# EAGLE design BalloonDogV3 (EAGLE 9.3.2)
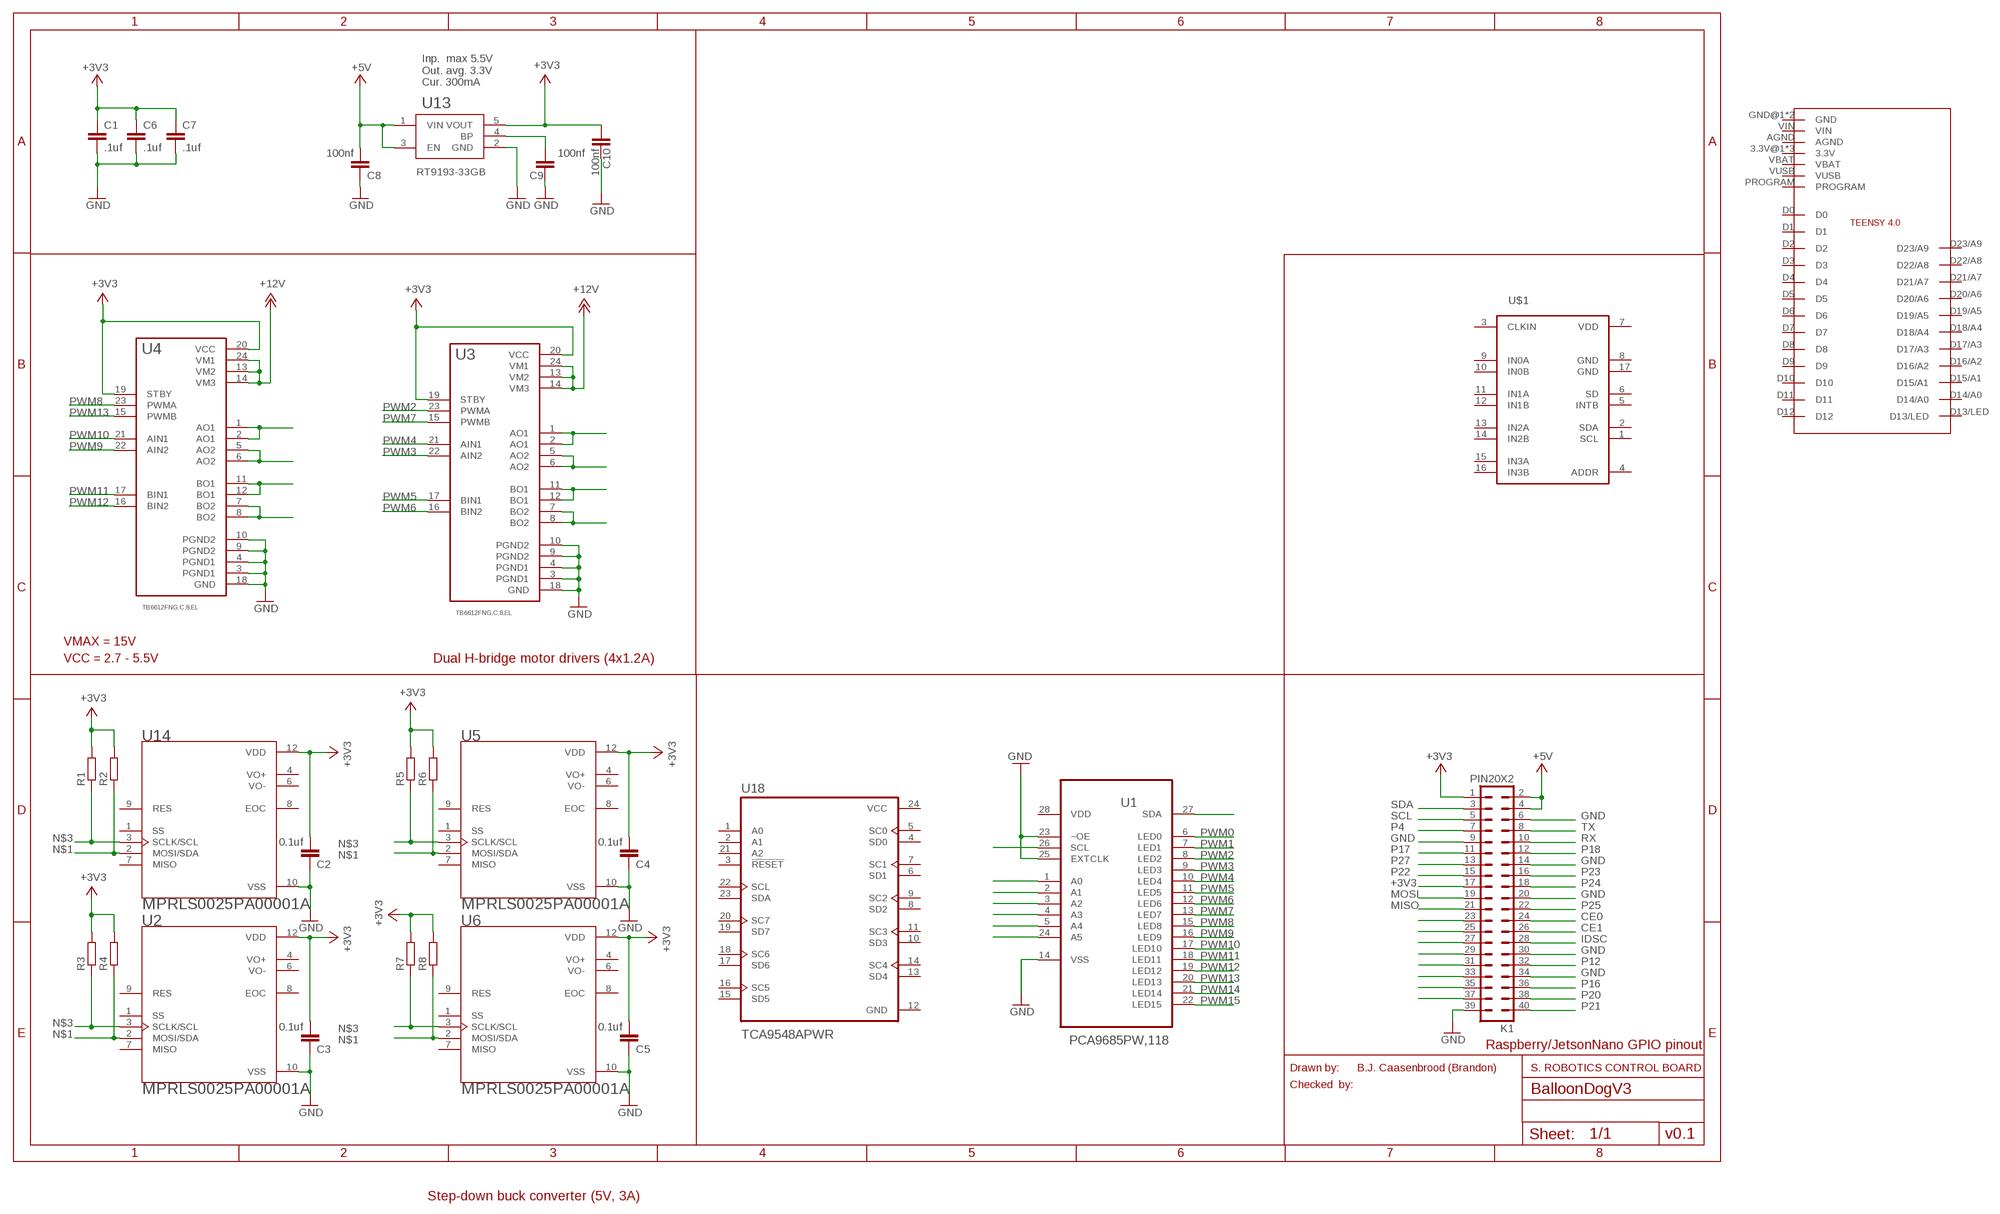
[diagram p0: schematic, sheet 1]

## Parts
C1  .1uf  C-EUC0805K  [C0805K]
C2  0.1uf  C-EUC0603  [C0603]
C3  0.1uf  C-EUC0603  [C0603]
C4  0.1uf  C-EUC0603  [C0603]
C5  0.1uf  C-EUC0603  [C0603]
C6  .1uf  C-EUC0805K  [C0805K]
C7  .1uf  C-EUC0805K  [C0805K]
C8  100nf  C-EUC0603  [C0603]
C9  100nf  C-EUC0603  [C0603]
C10  100nf  C-EUC0603  [C0603]
K1  PIN20X2  [PIN_20X2]
R1  R-EU_R0603  [R0603]
R2  R-EU_R0603  [R0603]
R3  R-EU_R0603  [R0603]
R4  R-EU_R0603  [R0603]
R5  R-EU_R0603  [R0603]
R6  R-EU_R0603  [R0603]
R7  R-EU_R0603  [R0603]
R8  R-EU_R0603  [R0603]
U1  PCA9685PW,118  [SOP65P640X110-28N]
U2  MPRLS0025PA00001A  [XDCR_MPRLS0025PA00001A]
U3  TB6612FNG,C,8,EL  [SOP65P760X160-24N]
U4  TB6612FNG,C,8,EL  [SOP65P760X160-24N]
U5  MPRLS0025PA00001A  [XDCR_MPRLS0025PA00001A]
U6  MPRLS0025PA00001A  [XDCR_MPRLS0025PA00001A]
U13  RT9193-33GB  [SOT94P279X129-5N]
U14  MPRLS0025PA00001A  [XDCR_MPRLS0025PA00001A]
U18  TCA9548APWR  [SOP65P640X120-24N]
U$1  LDC1614  [LDC1614]
U$2  TEENSY4.0  [TEENSY4.0]

## Nets
+3V3: C1.1 C2.2 C3.2 C4.2 C5.2 C6.1 C7.1 C10.2 K1.1 K1.17 R1.2 R2.2 R3.2 R4.2 R5.2 R6.2 R7.2 R8.2 U2.12(VDD) U3.19(STBY) U3.20(VCC) U4.19(STBY) U4.20(VCC) U5.12(VDD) U6.12(VDD) U13.5(VOUT) U14.12(VDD)
+5V: C8.2 K1.2 K1.4 U13.1(VIN) U13.3(EN)
+12V: U3.13(VM2) U3.14(VM3) U3.24(VM1) U4.13(VM2) U4.14(VM3) U4.24(VM1)
CE0: K1.24
CE1: K1.26
GND: C1.2 C2.1 C3.1 C4.1 C5.1 C6.2 C7.2 C8.1 C9.1 C10.1 K1.6 K1.9 K1.14 K1.20 K1.30 K1.34 K1.39 U1.14(VSS) U1.23(~OE) U1.25(EXTCLK) U2.10(VSS) U3.3(PGND1) U3.4(PGND1) U3.9(PGND2) U3.10(PGND2) U3.18(GND) U4.3(PGND1) U4.4(PGND1) U4.9(PGND2) U4.10(PGND2) U4.18(GND) U5.10(VSS) U6.10(VSS) U13.2(GND) U14.10(VSS)
IDSC: K1.28
MISO: K1.21
MOSI: K1.19
N$1: R2.1 R4.1 R6.1 R8.1 U2.2(MOSI/SDA) U5.2(MOSI/SDA) U6.2(MOSI/SDA) U14.2(MOSI/SDA)
N$2: K1.25
N$3: R1.1 R3.1 R5.1 R7.1 U2.3(SCLK/SCL) U5.3(SCLK/SCL) U6.3(SCLK/SCL) U14.3(SCLK/SCL)
N$9: K1.23
N$10: K1.27
N$11: K1.29
N$12: K1.31
N$13: K1.33
N$14: K1.35
N$15: K1.37
N$22: U3.1(AO1) U3.2(AO1)
N$23: U3.5(AO2) U3.6(AO2)
N$24: U3.11(BO1) U3.12(BO1)
N$25: U3.7(BO2) U3.8(BO2)
N$32: U4.1(AO1) U4.2(AO1)
N$33: U4.5(AO2) U4.6(AO2)
N$34: U4.11(BO1) U4.12(BO1)
N$35: U4.7(BO2) U4.8(BO2)
N$36: U1.27(SDA)
N$37: U1.26(SCL)
N$42: U1.1(A0)
N$43: U1.2(A1)
N$44: U1.3(A2)
N$45: U1.4(A3)
N$46: U1.5(A4)
N$47: U1.24(A5)
N$58: C9.2 U13.4(BP)
P4: K1.7
P12: K1.32
P16: K1.36
P17: K1.11
P18: K1.12
P20: K1.38
P21: K1.40
P22: K1.15
P23: K1.16
P24: K1.18
P25: K1.22
P27: K1.13
PWM0: U1.6(LED0)
PWM1: U1.7(LED1)
PWM2: U1.8(LED2) U3.23(PWMA)
PWM3: U1.9(LED3) U3.22(AIN2)
PWM4: U1.10(LED4) U3.21(AIN1)
PWM5: U1.11(LED5) U3.17(BIN1)
PWM6: U1.12(LED6) U3.16(BIN2)
PWM7: U1.13(LED7) U3.15(PWMB)
PWM8: U1.15(LED8) U4.23(PWMA)
PWM9: U1.16(LED9) U4.22(AIN2)
PWM10: U1.17(LED10) U4.21(AIN1)
PWM11: U1.18(LED11) U4.17(BIN1)
PWM12: U1.19(LED12) U4.16(BIN2)
PWM13: U1.20(LED13) U4.15(PWMB)
PWM14: U1.21(LED14)
PWM15: U1.22(LED15)
RX: K1.10
SCL: K1.5
SDA: K1.3
TX: K1.8
Unconnected: U2.1(SS) U2.4(VO+) U2.6(VO-) U2.7(MISO) U2.8(EOC) U2.9(RES) U5.1(SS) U5.4(VO+) U5.6(VO-) U5.7(MISO) U5.8(EOC) U5.9(RES) U6.1(SS) U6.4(VO+) U6.6(VO-) U6.7(MISO) U6.8(EOC) U6.9(RES) U14.1(SS) U14.4(VO+) U14.6(VO-) U14.7(MISO) U14.8(EOC) U14.9(RES) U18.1(A0) U18.2(A1) U18.3(!RESET) U18.4(SD0) U18.5(SC0) U18.6(SD1) U18.7(SC1) U18.8(SD2) U18.9(SC2) U18.10(SD3) U18.11(SC3) U18.13(SD4) U18.14(SC4) U18.15(SD5) U18.16(SC5) U18.17(SD6) U18.18(SC6) U18.19(SD7) U18.20(SC7) U18.21(A2) U18.22(SCL) U18.23(SDA) U$1.1(SCL) U$1.2(SDA) U$1.3(CLKIN) U$1.4(ADDR) U$1.5(INTB) U$1.6(SD) U$1.7(VDD) U$1.8(GND) U$1.9(IN0A) U$1.10(IN0B) U$1.11(IN1A) U$1.12(IN1B) U$1.13(IN2A) U$1.14(IN2B) U$1.15(IN3A) U$1.16(IN3B) U$1.17(GND) U$2.3.3V@1(3.3V) U$2.3.3V@2(3.3V) U$2.AGND U$2.D0 U$2.D1 U$2.D2 U$2.D3 U$2.D4 U$2.D5 U$2.D6 U$2.D7 U$2.D8 U$2.D9 U$2.D10 U$2.D11 U$2.D12 U$2.D13/LED U$2.D14/A0 U$2.D15/A1 U$2.D16/A2 U$2.D17/A3 U$2.D18/A4 U$2.D19/A5 U$2.D20/A6 U$2.D21/A7 U$2.D22/A8 U$2.D23/A9 U$2.GND@1(GND) U$2.GND@2(GND) U$2.ON/OFF(3.3V) U$2.PROGRAM U$2.VBAT U$2.VIN U$2.VUSB

## Notes on the sheet
- Inp.  max 5.5V
  Out. avg. 3.3V
  Cur. 300mA
- VMAX = 15V
- VCC = 2.7 - 5.5V | Dual H-bridge motor drivers (4x1.2A)
- Raspberry/JetsonNano GPIO pinout
- Drawn by: | B.J. Caasenbrood (Brandon) | S. ROBOTICS CONTROL BOARD
- Checked  by:
- v0.1
- Step-down buck converter (5V, 3A)

## Power pins joined to a net without a drawn wire
GND: U18.12(GND)
VCC: U18.24(VCC)
VDD: U1.28(VDD)

## Library data of the parts
C1 C6 C7 = resistor:C-EU: CAPACITOR, European symbol; DIELECTRIC: X7R
C2-C5 C8-C10 = rcl:C-EU: CAPACITOR, European symbol; SPICEPREFIX: C
K1 = FLYFISH:PIN20X2
R1-R8 = rcl:R-EU_: RESISTOR, European symbol; SPICEPREFIX: R
U1 = PCA9685PW_118:PCA9685PW,118: 16-channel, 12-bit PWM Fm+ I2C-bus LED controller; AVAILABILITY: Unavailable; DESCRIPTION: PCA9685 Series 5.5V 25 mA 1 MHz 12-bit PWM Fm+I2C-Bus LED Controller - TSSOP-28; MF: NXP USA; MP: PCA9685PW,118; PACKAGE: TSSOP-28 NXP Semiconductors; PRICE: None
U2 U5 U6 U14 = MPRLS0025PA00001A:MPRLS0025PA00001A: Pressure Sensor 0psi to 25psi Absolute 12-Pin T/R; AVAILABILITY: Unavailable; DESCRIPTION: Pressure Sensor 0psi to 25psi Absolute 12-Pin T/R; MF: Honeywell Sensing; MP: MPRLS0025PA00001A; PACKAGE: SMD-10 Honeywell; PRICE: None
U3 U4 = TB6612FNG_C_8_EL:TB6612FNG,C,8,EL: Stepping Motor Driver Ic Unipolor Copper Wire 8"; DESCRIPTION: Stepping Motor Driver Ic Unipolor Copper Wire 8; DIGI-KEY_PART_NUMBER: TB6612FNGC8ELCT-ND; DIGI-KEY_PURCHASE_URL: https://www.digikey.nl/product-detail/en/toshiba-semiconductor-and-storage/TB6612FNG,C,8,EL/TB6612FNGC8ELCT-ND/1730134?WT.z_cid=ref_snapeda&utm_source=snapeda&utm_medium=aggregator&utm_campaign=buynow; MF: Toshiba; MP: TB6612FNG,C,8,EL; PACKAGE: SSOP-24 Toshiba
U13 = RT9193-33GB:RT9193-33GB: RT9193 Series 300 mA 3.3 V Ultra-Low Noise Ultra-Fast CMOS LDO Regulator-SC-70-5; AVAILABILITY: Unavailable; DESCRIPTION: RT9193 Series 300 mA 3.3 V Ultra-Low Noise Ultra-Fast CMOS LDO Regulator-SC-70-5; MF: Richtek USA; MP: RT9193-33GB; PACKAGE: SOT-23-5 Richtek; PRICE: None
U18 = TCA9548APWR:TCA9548APWR: Low-Voltage 8-Channel I2C Switch With Reset 24-TSSOP -40 to 85; AVAILABILITY: Unavailable; DESCRIPTION: Low-Voltage 8-Channel I2C Switch With Reset 24-TSSOP -40 to 85; MF: Texas Instruments; MP: TCA9548APWR; PACKAGE: TSSOP-24 Texas Instruments; PRICE: None
U$1 = LDC1614RGHT:LDC1614
U$2 = Teensy4.0:TEENSY4.0

## Board
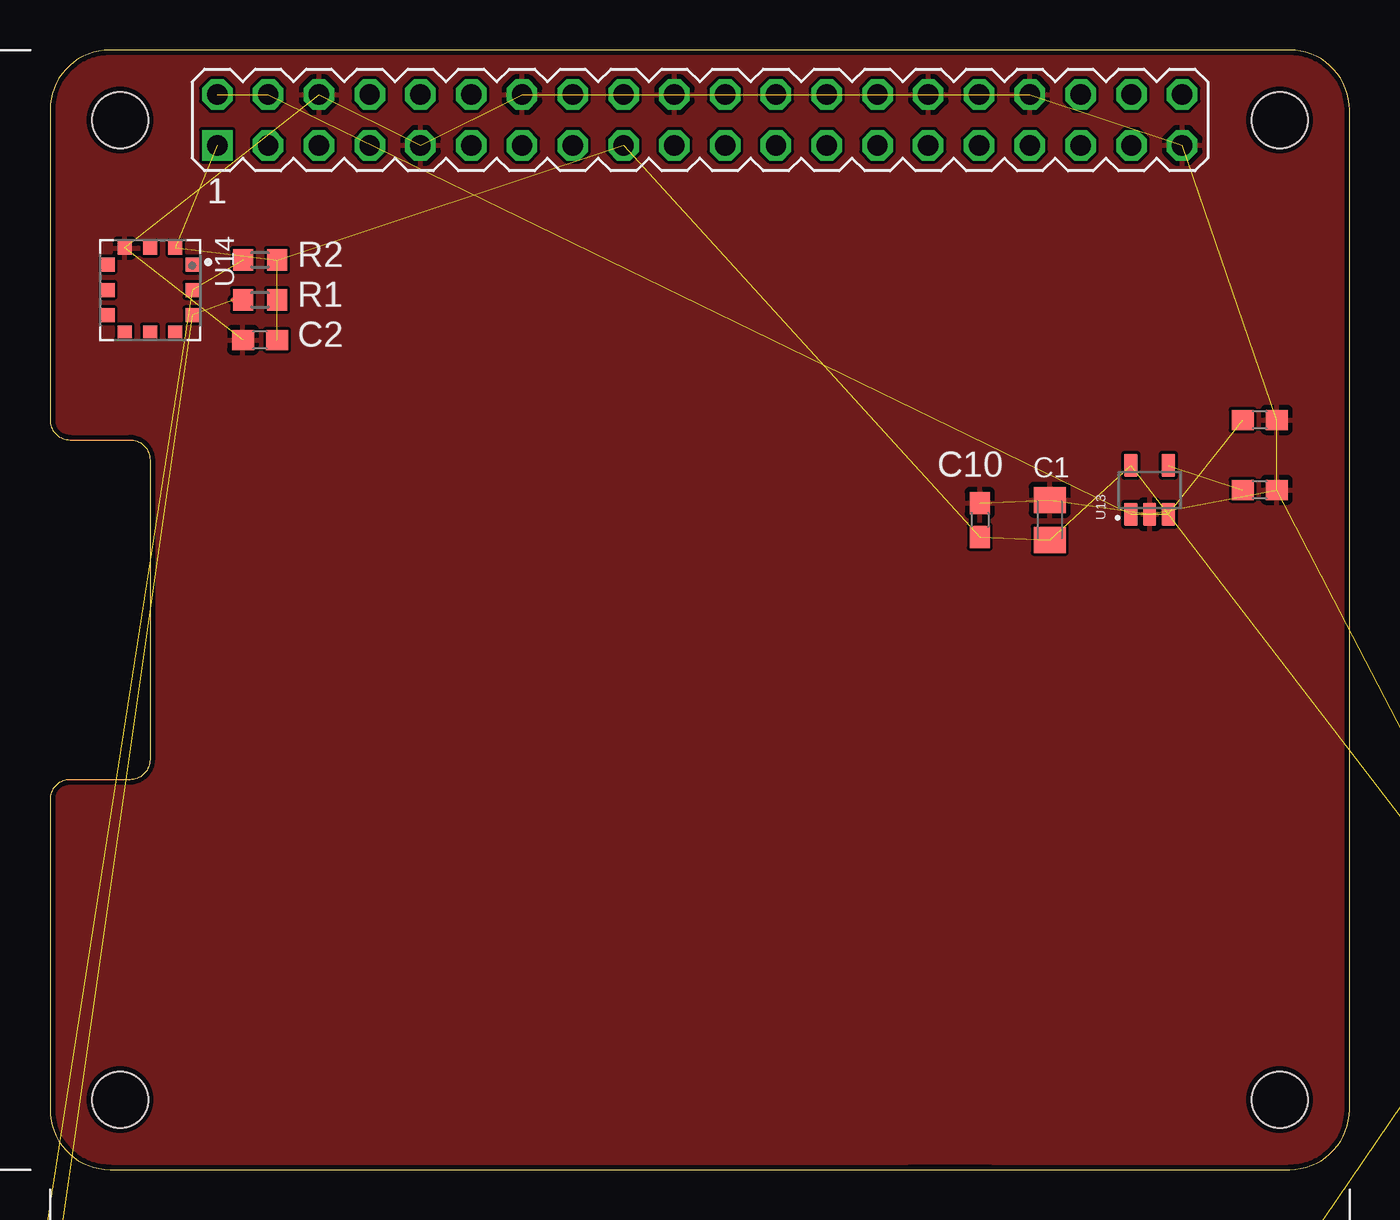
[diagram p1: board, top side]
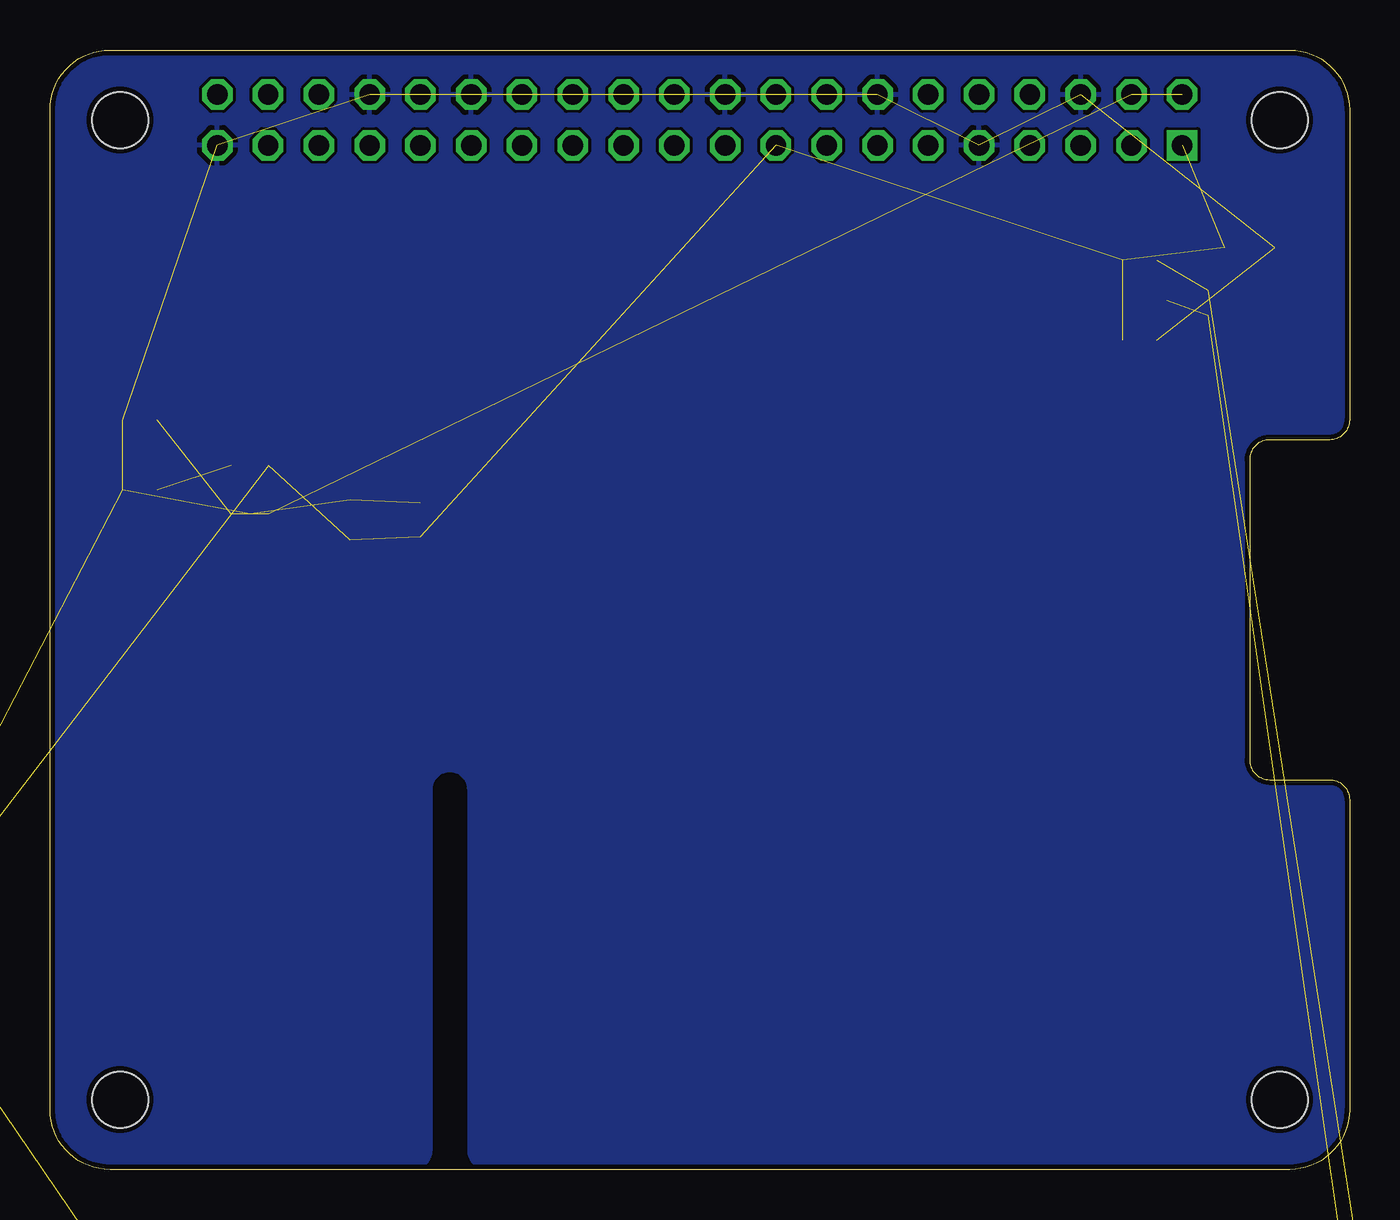
[diagram p2: board, bottom side, seen from below]

Size 65 x 56 mm. Coordinates in mm from the lower left corner, seen from the top.
Outline: 0,3 arc90 3,0 43,0 47,0 62,0 arc90 65,3 65,53 arc90 62,56 3,56 arc90 0,53 0,37.5 arc90 1,36.5 4,36.5 arc-90 5,35.5 5,20.5 arc-90 4,19.5 1,19.5 arc90 0,18.5 0,3
Copper layers ([2:1+2*15+16:15]): Top 0.035mm / dielectric 15mil / Route2 0.035mm / dielectric 27mil / Route15 0.035mm / dielectric 15mil / Bottom 0.035mm
Design rules "ITEADstudio_DRC *": minimum track width 6mil, minimum drill 12mil, track to track 6mil, track to pad 6mil, pad to pad 6mil, via to via 6mil, smd to smd 0mil, copper to edge 10mil, drill to drill 10mil, minimum pad ring 10mil, minimum via ring 6mil, stop-mask expansion 2mil, vias tented up to drill 100mil, thermal gap 10mil
Holes 2.8 mm at 3.5,3.5 3.5,52.5 61.5,52.5 61.5,3.5

### Footprints (pad centres in the part's own frame; a part is rotated, then mirrored left to right if it is on the bottom)
C0805K = smd 1.3 x 1.6: 1 -1,0; 2 1,0
C0603 = smd 1.1 x 1: 1 -0.85,0; 2 0.85,0
PIN_20X2 = drill 1.016 square: 1 -24.13,-1.27 | drill 1.016 octagon: 2 -24.13,1.27; 3 -21.59,-1.27; 4 -21.59,1.27; 5 -19.05,-1.27; 6 -19.05,1.27; 7 -16.51,-1.27; 8 -16.51,1.27; 9 -13.97,-1.27; 10 -13.97,1.27; 11 -11.43,-1.27; 12 -11.43,1.27; 13 -8.89,-1.27; 14 -8.89,1.27; 15 -6.35,-1.27; 16 -6.35,1.27; 17 -3.81,-1.27; 18 -3.81,1.27; 19 -1.27,-1.27; 20 -1.27,1.27; 21 1.27,-1.27; 22 1.27,1.27; 23 3.81,-1.27; 24 3.81,1.27; 25 6.35,-1.27; 26 6.35,1.27; 27 8.89,-1.27; 28 8.89,1.27; 29 11.43,-1.27; 30 11.43,1.27; 31 13.97,-1.27; 32 13.97,1.27; 33 16.51,-1.27; 34 16.51,1.27; 35 19.05,-1.27; 36 19.05,1.27; 37 21.59,-1.27; 38 21.59,1.27; 39 24.13,-1.27; 40 24.13,1.27
R0603 = smd 1 x 1.1: 1 -0.85,0; 2 0.85,0
SOP65P640X110-28N = smd 1.473 x 0.356: 1 -2.921,4.216; 2 -2.921,3.581; 3 -2.921,2.921; 4 -2.921,2.286; 5 -2.921,1.626; 6 -2.921,0.965; 7 -2.921,0.33; 8 -2.921,-0.33; 9 -2.921,-0.965; 10 -2.921,-1.626; 11 -2.921,-2.286; 12 -2.921,-2.921; 13 -2.921,-3.581; 14 -2.921,-4.216; 15 2.921,-4.216; 16 2.921,-3.581; 17 2.921,-2.921; 18 2.921,-2.286; 19 2.921,-1.626; 20 2.921,-0.965; 21 2.921,-0.33; 22 2.921,0.33; 23 2.921,0.965; 24 2.921,1.626; 25 2.921,2.286; 26 2.921,2.921; 27 2.921,3.581; 28 2.921,4.216
XDCR_MPRLS0025PA00001A = smd 0.7 x 0.65: 1 -1.27,2.1; 2 0,2.1; 3 1.27,2.1; 7 1.27,-2.1; 8 0,-2.1; 9 -1.27,-2.1 | smd 0.65 x 0.7: 4 2.1,1.27; 5 2.1,0; 6 2.1,-1.27; 10 -2.1,-1.27; 11 -2.1,0; 12 -2.1,1.27
SOP65P760X160-24N = smd 1.5 x 0.4: 1 -3.625,3.575; 2 -3.625,2.925; 3 -3.625,2.275; 4 -3.625,1.625; 5 -3.625,0.975; 6 -3.625,0.325; 7 -3.625,-0.325; 8 -3.625,-0.975; 9 -3.625,-1.625; 10 -3.625,-2.275; 11 -3.625,-2.925; 12 -3.625,-3.575; 13 3.625,-3.575; 14 3.625,-2.925; 15 3.625,-2.275; 16 3.625,-1.625; 17 3.625,-0.975; 18 3.625,-0.325; 19 3.625,0.325; 20 3.625,0.975; 21 3.625,1.625; 22 3.625,2.275; 23 3.625,2.925; 24 3.625,3.575
SOT94P279X129-5N = smd 1.17 x 0.67: 1 -1.22,0.94; 2 -1.22,0; 3 -1.22,-0.94; 4 1.22,-0.94; 5 1.22,0.94
SOP65P640X120-24N = smd 1.57 x 0.41: 1 -2.87,3.575; 2 -2.87,2.925; 3 -2.87,2.275; 4 -2.87,1.625; 5 -2.87,0.975; 6 -2.87,0.325; 7 -2.87,-0.325; 8 -2.87,-0.975; 9 -2.87,-1.625; 10 -2.87,-2.275; 11 -2.87,-2.925; 12 -2.87,-3.575; 13 2.87,-3.575; 14 2.87,-2.925; 15 2.87,-2.275; 16 2.87,-1.625; 17 2.87,-0.975; 18 2.87,-0.325; 19 2.87,0.325; 20 2.87,0.975; 21 2.87,1.625; 22 2.87,2.275; 23 2.87,2.925; 24 2.87,3.575
LDC1614 = smd 0.813 x 0.305: 1 -1.956,0.762; 2 -1.956,0.254; 3 -1.956,-0.254; 4 -1.956,-0.762; 9 1.956,-0.762; 10 1.956,-0.254; 11 1.956,0.254; 12 1.956,0.762 | smd 0.305 x 0.813: 5 -0.762,-1.956; 6 -0.254,-1.956; 7 0.254,-1.956; 8 0.762,-1.956; 13 0.762,1.956; 14 0.254,1.956; 15 -0.254,1.956; 16 -0.762,1.956 | smd 2.591 x 2.591: 17 0,0
TEENSY4.0 = drill 0.8: 3.3V@1 7.62,10.16; 3.3V@2 -2.54,-17.78; AGND 7.62,12.7; D0 -7.62,12.7; D1 -7.62,10.16; D2 -7.62,7.62; D3 -7.62,5.08; D4 -7.62,2.54; D5 -7.62,0; D6 -7.62,-2.54; D7 -7.62,-5.08; D8 -7.62,-7.62; D9 -7.62,-10.16; D10 -7.62,-12.7; D11 -7.62,-15.24; D12 -7.62,-17.78; D13/LED 7.62,-17.78; D14/A0 7.62,-15.24; D15/A1 7.62,-12.7; D16/A2 7.62,-10.16; D17/A3 7.62,-7.62; D18/A4 7.62,-5.08; D19/A5 7.62,-2.54; D20/A6 7.62,0; D21/A7 7.62,2.54; D22/A8 7.62,5.08; D23/A9 7.62,7.62; GND@1 -7.62,15.24; GND@2 0,-17.78; ON/OFF 5.08,-17.78; PROGRAM 2.54,-17.78; VBAT -5.08,-17.78; VIN 7.62,15.24; VUSB 5.08,12.7

### Placement (x,y rotation side)
C1  50,32.5 90 top
C2  10.5,41.5 0 top
C3  -8.5,-52.5 0 top  (outside the outline)
C4  -8.5,-76.5 0 top  (outside the outline)
C5  -3,-76.5 0 top  (outside the outline)
C6  71.5,13.5 90 top  (outside the outline)
C7  70.5,8.5 90 top  (outside the outline)
C8  60.5,37.5 180 top
C9  60.5,34 180 top
C10  46.5,32.5 270 top
K1  32.5,52.5 0 top
R1  10.5,43.5 0 top
R2  10.5,45.5 0 top
R3  -3,-52.5 0 top  (outside the outline)
R4  1,-52.5 0 top  (outside the outline)
R5  2.5,-76.5 0 top  (outside the outline)
R6  6.5,-76.5 0 top  (outside the outline)
R7  -8.5,-81.5 0 top  (outside the outline)
R8  -4.5,-81.5 0 top  (outside the outline)
U1  29.5,-20.5 270 top  (outside the outline)
U2  -6.5,-45.5 0 top  (outside the outline)
U3  43,-20 90 top  (outside the outline)
U4  54.5,-20 90 top  (outside the outline)
U5  -6.5,-60 0 top  (outside the outline)
U6  -6.5,-69.5 0 top  (outside the outline)
U13  55,34 90 top
U14  5,44 270 top
U18  73.5,-10.5 90 top  (outside the outline)
U$1  90,18.5 0 top  (outside the outline)
U$2  92,35 90 top  (outside the outline)

### Tracks (layer width: path | path; a pad name or v marks a point on that pad's centre or on a via)
+3V3  (26 unrouted)
+5V  (4 unrouted)
+12V  (5 unrouted)
GND  (35 unrouted)
  pour Bottom: 0,3 arc90 3,0 43,0 arc90 44,1 44,19 arc-90 45,20 arc-90 46,19 46,1 arc90 47,0 62,0 arc90 65,3 65,53 arc90 62,56 3,56 arc90 0,53 0,37.5 arc90 1,36.5 4,36.5 arc-90 5,35.5 5,20.5 arc-90 4,19.5 1,19.5 arc90 0,18.5
  pour Top: 0,3 arc90 3,0 62,0 arc90 65,3 65,53 arc90 62,56 3,56 arc90 0,53 0,37.5 arc90 1,36.5 4,36.5 arc-90 5,35.5 5,20.5 arc-90 4,19.5 1,19.5 arc90 0,18.5
N$1  (7 unrouted)
N$3  (7 unrouted)
  Top 0.254: R1.1 9.15,43.5
N$22  (1 unrouted)
N$23  (1 unrouted)
N$24  (1 unrouted)
N$25  (1 unrouted)
N$32  (1 unrouted)
N$33  (1 unrouted)
N$34  (1 unrouted)
N$35  (1 unrouted)
N$58  (1 unrouted)
PWM2  (1 unrouted)
PWM3  (1 unrouted)
PWM4  (1 unrouted)
PWM5  (1 unrouted)
PWM6  (1 unrouted)
PWM7  (1 unrouted)
PWM8  (1 unrouted)
PWM9  (1 unrouted)
PWM10  (1 unrouted)
PWM11  (1 unrouted)
PWM12  (1 unrouted)
PWM13  (1 unrouted)